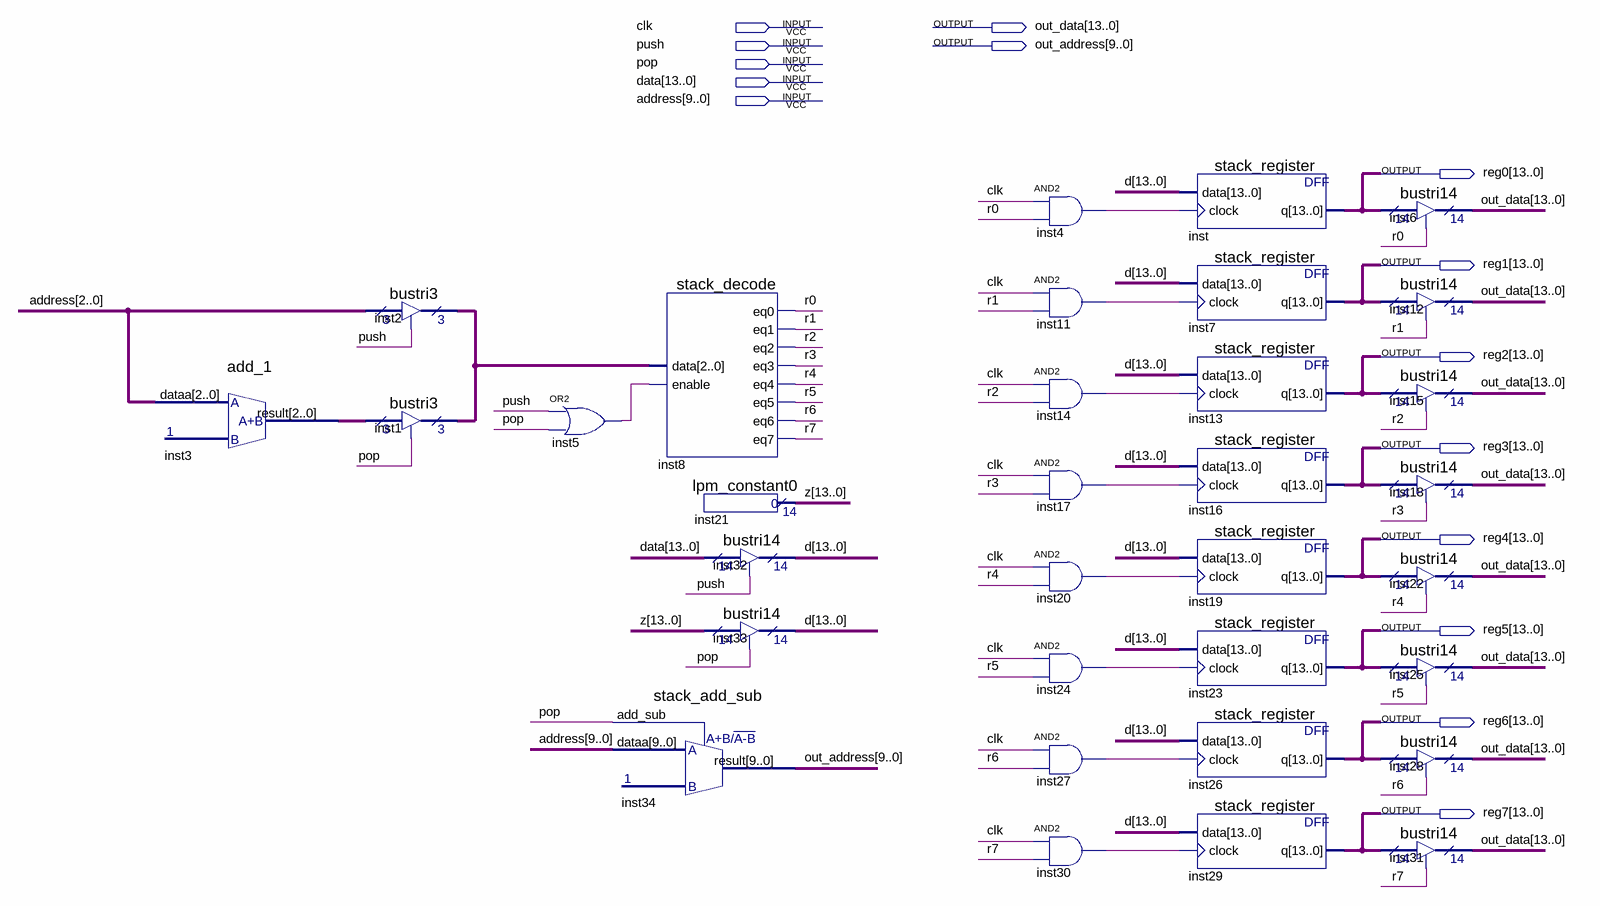
[diagram p0: schematic sheet]
// Quartus schematic stack.bdf as structural Verilog: 33 symbols, 15 pins
module stack (
  input  clk,
  input  push,
  input  pop,
  input  [13:0] data,
  input  [9:0] address,
  output [13:0] out_data,
  output [9:0] out_address,
  output [13:0] reg0,
  output [13:0] reg1,
  output [13:0] reg2,
  output [13:0] reg3,
  output [13:0] reg4,
  output [13:0] reg5,
  output [13:0] reg6,
  output [13:0] reg7
);

  wire inst4_out, inst5_out, inst11_out, inst14_out, inst17_out, inst20_out, inst24_out, inst27_out,
       inst30_out, r0, r1, r2, r3, r4, r5, r6, r7;
  wire [2:0] inst2_tridata, inst3_result;
  wire [13:0] d, z;

  add_1 inst3 (.dataa(address[2:0]), .result(inst3_result));
  bustri3 inst2 (.enabledt(push), .data(address[2:0]), .tridata(inst2_tridata));
  bustri3 inst1 (.enabledt(pop), .data(inst3_result), .tridata(inst2_tridata));
  or inst5 (inst5_out, push, pop);
  stack_decode inst8 (
    .data(inst2_tridata), .enable(inst5_out), .eq0(r0), .eq1(r1), .eq2(r2), .eq3(r3), .eq4(r4), .eq5(r5),
    .eq6(r6), .eq7(r7));
  stack_add_sub inst34 (.dataa(address), .add_sub(pop), .result(out_address));
  lpm_constant0 inst21 (.result(z));
  bustri14 inst32 (.enabledt(push), .data(data), .tridata(d));
  bustri14 inst33 (.enabledt(pop), .data(z), .tridata(d));
  and inst4 (inst4_out, clk, r0);
  and inst11 (inst11_out, clk, r1);
  and inst14 (inst14_out, clk, r2);
  and inst17 (inst17_out, clk, r3);
  and inst20 (inst20_out, clk, r4);
  and inst24 (inst24_out, clk, r5);
  and inst27 (inst27_out, clk, r6);
  and inst30 (inst30_out, clk, r7);
  stack_register inst (.data(d), .clock(inst4_out), .q(reg0));
  stack_register inst7 (.data(d), .clock(inst11_out), .q(reg1));
  stack_register inst13 (.data(d), .clock(inst14_out), .q(reg2));
  stack_register inst16 (.data(d), .clock(inst17_out), .q(reg3));
  stack_register inst19 (.data(d), .clock(inst20_out), .q(reg4));
  stack_register inst23 (.data(d), .clock(inst24_out), .q(reg5));
  stack_register inst26 (.data(d), .clock(inst27_out), .q(reg6));
  stack_register inst29 (.data(d), .clock(inst30_out), .q(reg7));
  bustri14 inst6 (.enabledt(r0), .data(reg0), .tridata(out_data));
  bustri14 inst12 (.enabledt(r1), .data(reg1), .tridata(out_data));
  bustri14 inst15 (.enabledt(r2), .data(reg2), .tridata(out_data));
  bustri14 inst18 (.enabledt(r3), .data(reg3), .tridata(out_data));
  bustri14 inst22 (.enabledt(r4), .data(reg4), .tridata(out_data));
  bustri14 inst25 (.enabledt(r5), .data(reg5), .tridata(out_data));
  bustri14 inst28 (.enabledt(r6), .data(reg6), .tridata(out_data));
  bustri14 inst31 (.enabledt(r7), .data(reg7), .tridata(out_data));
endmodule
